# Altium schematic sheet 去耦电容&接口.SchDoc
size A4
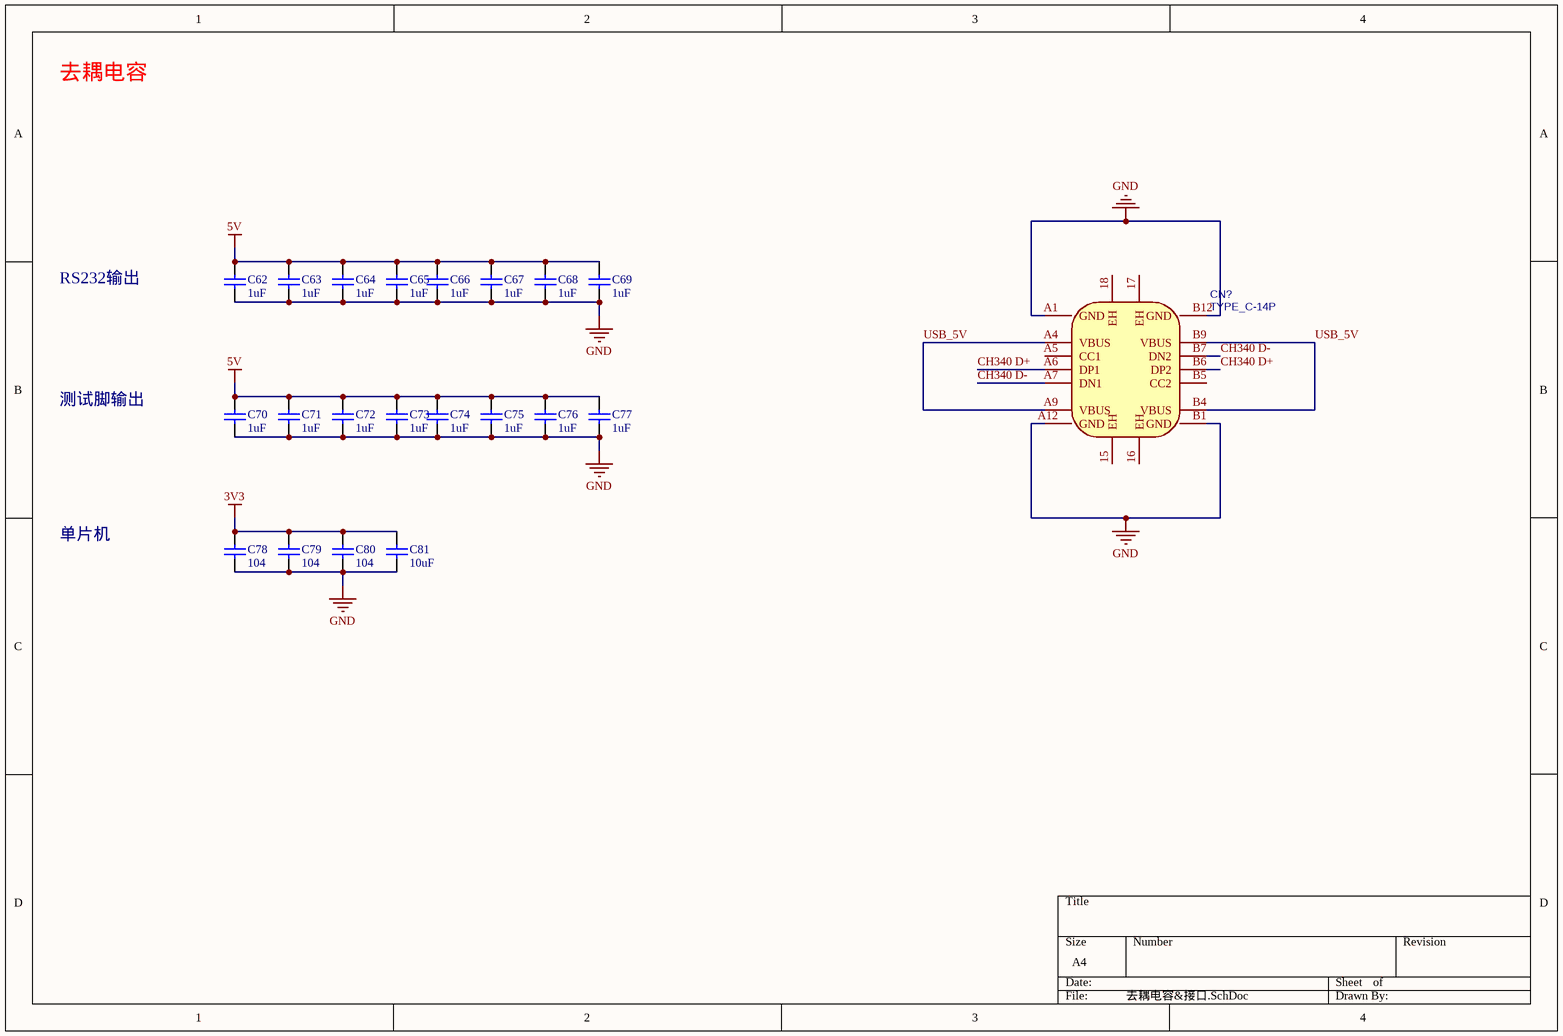
[diagram p0: 去耦电容&接口.SchDoc]

## Parts
C62  1uF  [0603_C]
C63  1uF  [0603_C]
C64  1uF  [0603_C]
C65  1uF  [0603_C]
C66  1uF  [0603_C]
C67  1uF  [0603_C]
C68  1uF  [0603_C]
C69  1uF  [0603_C]
C70  1uF  [0603_C]
C71  1uF  [0603_C]
C72  1uF  [0603_C]
C73  1uF  [0603_C]
C74  1uF  [0603_C]
C75  1uF  [0603_C]
C76  1uF  [0603_C]
C77  1uF  [0603_C]
C78  104  [0603_C]
C79  104  [0603_C]
C80  104  [0603_C]
C81  10uF  [0603_C]
CN?  TYPE_C-14P  [USB-C-SMD_KH-TYPE-C-16P]

## Nets
3V3: C78.2 C79.2 C80.2 C81.2
5V: C62.2 C63.2 C64.2 C65.2 C66.2 C67.2 C68.2 C69.2 C70.2 C71.2 C72.2 C73.2 C74.2 C75.2 C76.2 C77.2
GND: C62.1 C63.1 C64.1 C65.1 C66.1 C67.1 C68.1 C69.1 C70.1 C71.1 C72.1 C73.1 C74.1 C75.1 C76.1 C77.1 C78.1 C79.1 C80.1 C81.1 CN?.A1(GND) CN?.A12(GND) CN?.B1(GND) CN?.B12(GND)
CH340 D+: CN?.A6(DP1) CN?.B6(DP2)
CH340 D-: CN?.A7(DN1) CN?.B7(DN2)
USB_5V: CN?.A4(VBUS) CN?.A9(VBUS) CN?.B4(VBUS) CN?.B9(VBUS)

Not connected (* = marked no-connect by the designer): CN? 15(EH) 16(EH) 17(EH) 18(EH) A5(CC1) B5(CC2)

## Notes on the sheet
- 去耦电容
- RS232输出
- 测试脚输出
- 单片机

## Library data of the parts
C62-C81 = 0603 1uF (105) 10% 50V: 贴片电容; ComponentLink1Description: 供应商链接; ComponentLink1URL: http://www.szlcsc.com/product/details_16531.html; Package: 0603; Supplier: LC; SuppliersPartNumber: C15849
CN? = TYPE_C-14P: BOM_Manufacturer: Korean Hroparts Elec; BOM_Manufacturer Part: TYPE-C-31-M-18; Contributor: LCSC; BOM_Supplier: LCSC; BOM_Supplier Part: C530609; spicePre: U; spiceSymbolName: TYPE-C-31-M-18